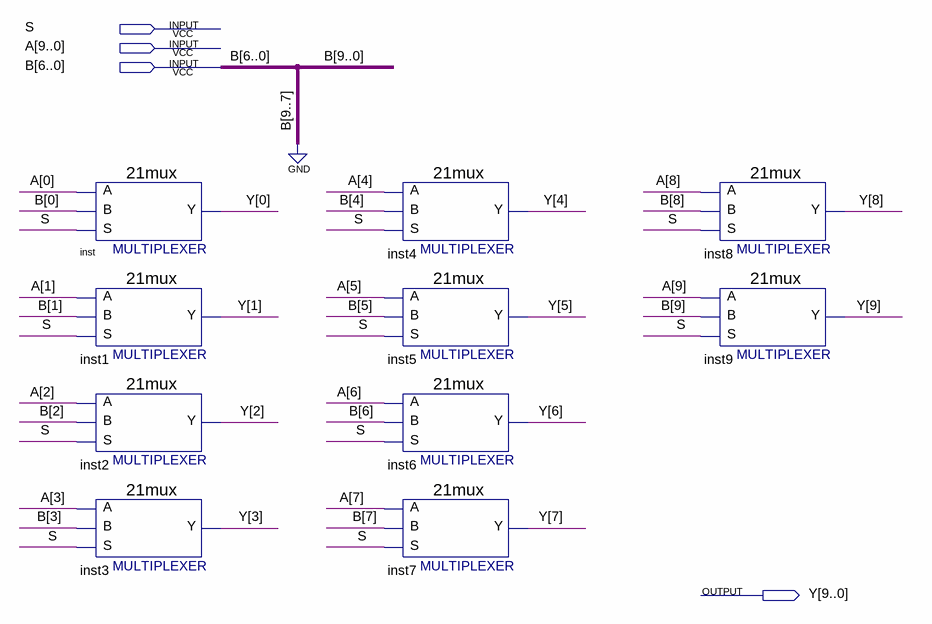
[diagram p0: schematic sheet]
// Quartus schematic mux21_10bit.bdf as structural Verilog: 10 symbols, 4 pins
module mux21_10bit (
  input  S,
  input  [9:0] A,
  input  [6:0] B,
  output [9:0] Y
);

  \21mux  inst (.S(S), .B(B[0]), .A(A[0]), .Y(Y[0]));
  \21mux  inst1 (.S(S), .B(B[1]), .A(A[1]), .Y(Y[1]));
  \21mux  inst2 (.S(S), .B(B[2]), .A(A[2]), .Y(Y[2]));
  \21mux  inst3 (.S(S), .B(B[3]), .A(A[3]), .Y(Y[3]));
  \21mux  inst4 (.S(S), .B(B[4]), .A(A[4]), .Y(Y[4]));
  \21mux  inst5 (.S(S), .B(B[5]), .A(A[5]), .Y(Y[5]));
  \21mux  inst6 (.S(S), .B(B[6]), .A(A[6]), .Y(Y[6]));
  \21mux  inst7 (.S(S), .B(1'b0), .A(A[7]), .Y(Y[7]));
  \21mux  inst8 (.S(S), .B(1'b0), .A(A[8]), .Y(Y[8]));
  \21mux  inst9 (.S(S), .B(1'b0), .A(A[9]), .Y(Y[9]));
endmodule
